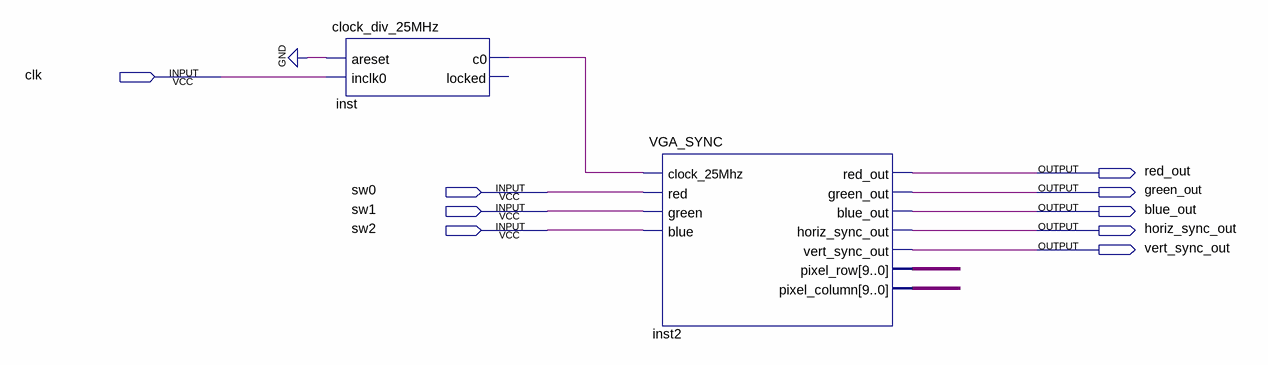
[diagram p0: schematic sheet]
// Quartus schematic Test_VGA.bdf as structural Verilog: 2 symbols, 9 pins
module Test_VGA (
  input  clk,
  input  sw0,
  input  sw1,
  input  sw2,
  output red_out,
  output green_out,
  output blue_out,
  output horiz_sync_out,
  output vert_sync_out
);

  wire inst_c0;
  wire [9:0] inst2_pixel_column, inst2_pixel_row;

  clock_div_25MHz inst (.areset(1'b0), .inclk0(clk), .c0(inst_c0));  // open: locked
  VGA_SYNC inst2 (
    .clock_25Mhz(inst_c0), .red(sw0), .green(sw1), .blue(sw2), .red_out(red_out), .green_out(green_out),
    .blue_out(blue_out), .horiz_sync_out(horiz_sync_out), .vert_sync_out(vert_sync_out),
    .pixel_row(inst2_pixel_row), .pixel_column(inst2_pixel_column));
endmodule
